# EAGLE design SML_IR-Sensor (EAGLE 9.6.2)
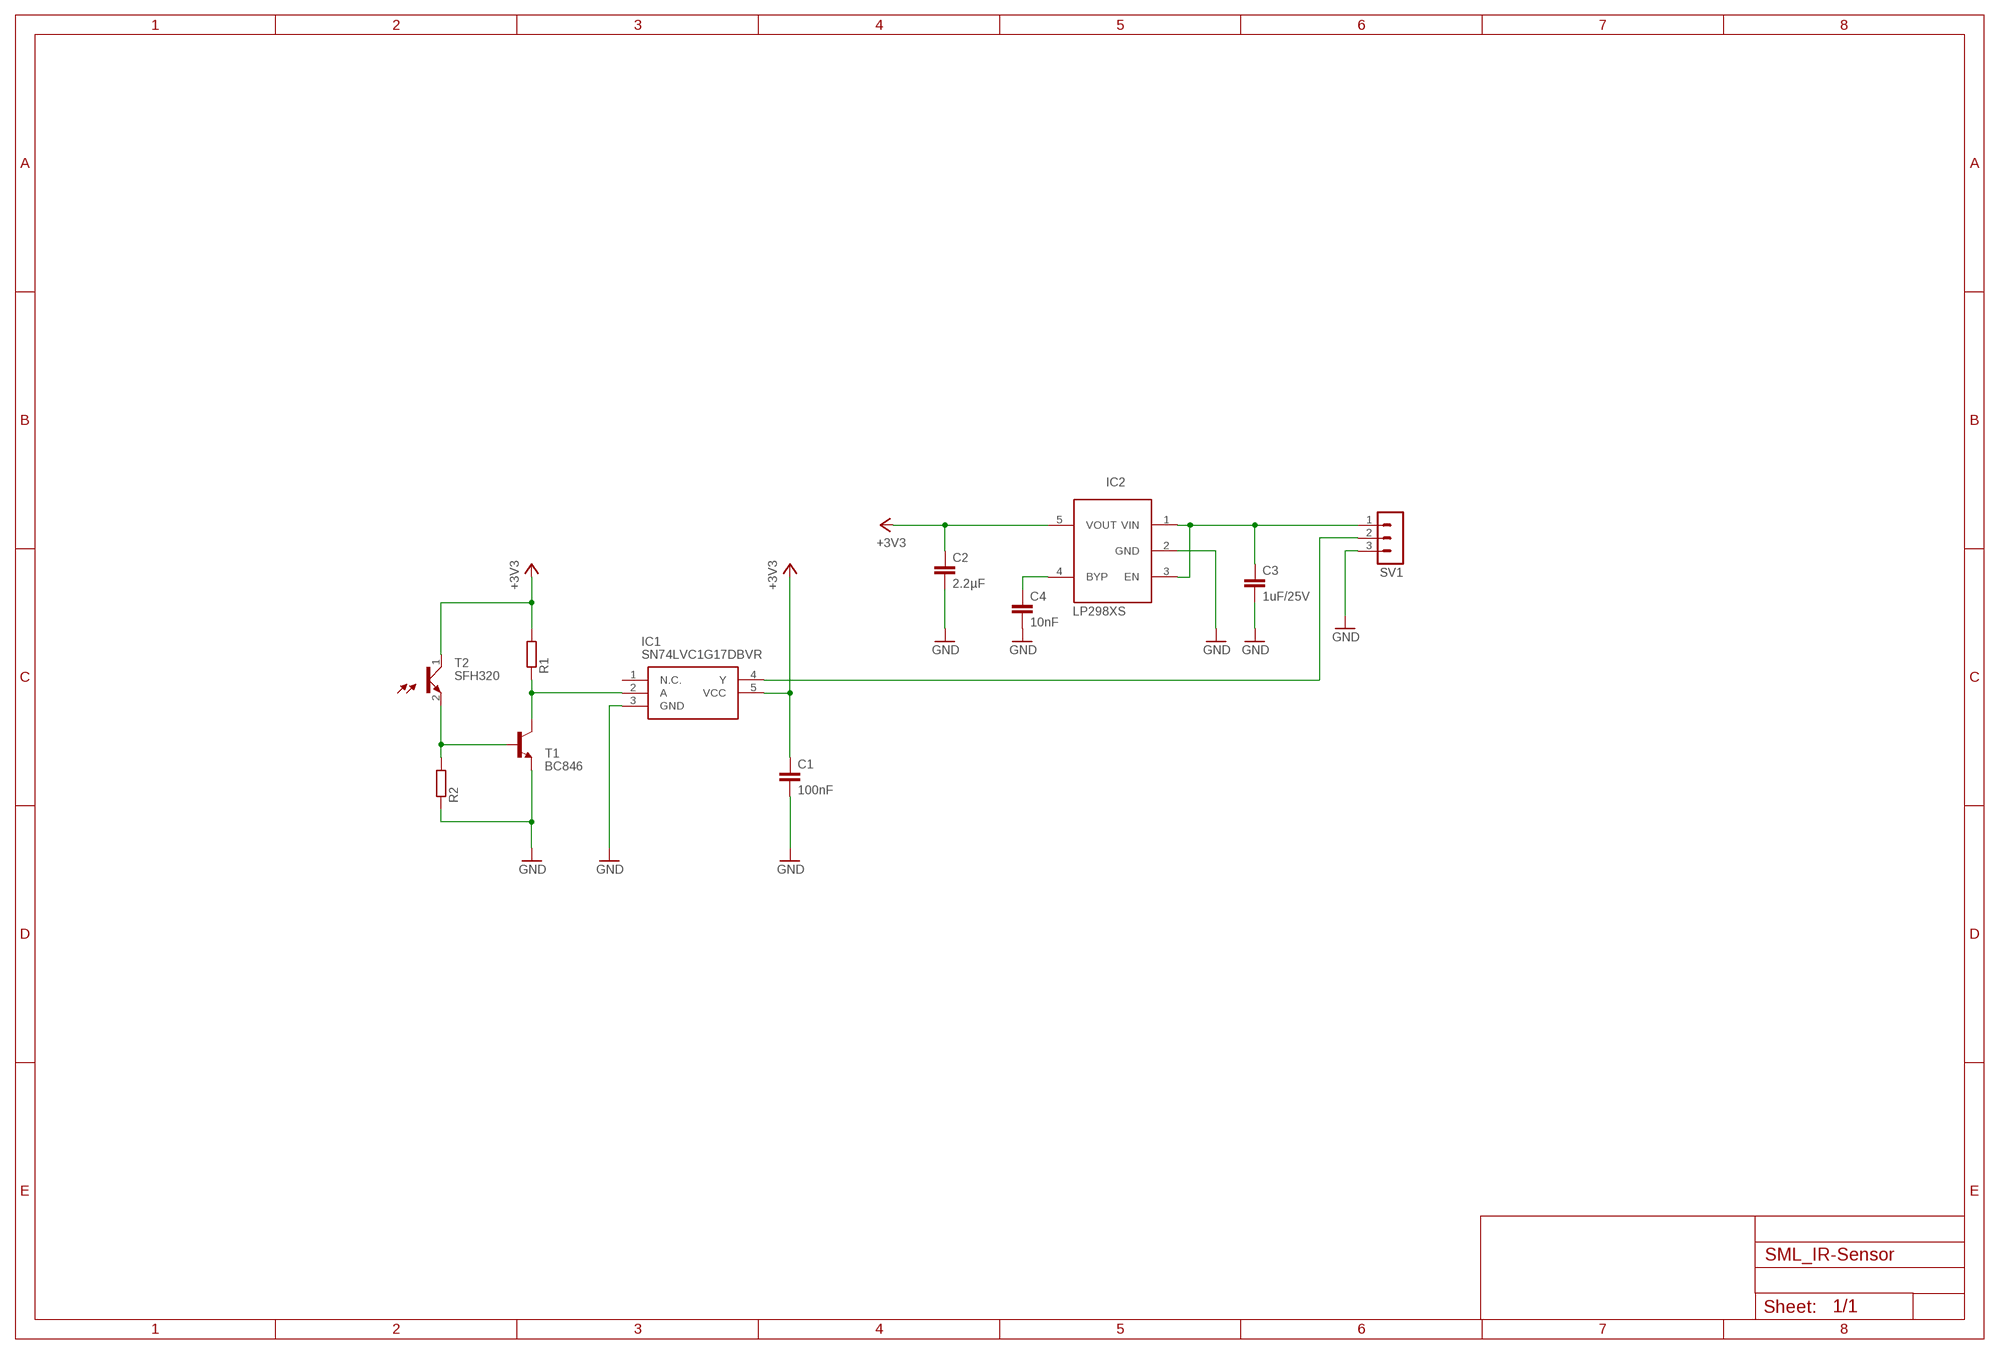
[diagram p0: schematic, sheet 1]

## Parts
C1  100nF  C-EUC0603  [C0603]
C2  2.2µF  C-EUC0603  [C0603]
C3  1uF/25V  C-EUC0603  [C0603]
C4  10nF  C-EUC0603  [C0603]
IC1  SN74LVC1G17DBVR  [SOT95P280X145-5N]
IC2  LP298XS  [SOT23-5L]
R1  R-EU_R0603  [R0603]
R2  R-EU_R0603  [R0603]
SV1  MA03-1  [MA03-1]
T1  BC846  [SOT23]
T2  SFH320  [LEDM3528X210N]

## Nets
+3V3: C1.1 C2.1 IC1.5(VCC) IC2.5(VOUT) R1.2 T2.1(C)
GND: C1.2 C2.2 C3.2 C4.2 IC1.3(GND) IC2.2(GND) R2.1 SV1.3 T1.2(E)
N$1: IC1.2(A) R1.1 T1.3(C)
N$2: IC1.4(Y) SV1.2
N$3: R2.2 T1.1(B) T2.2(E)
N$4: C3.1 IC2.1(VIN) IC2.3(EN) SV1.1
N$5: C4.1 IC2.4(BYP)
Unconnected: IC1.1(N.C.)

## Library data of the parts
C1-C4 = rcl:C-EU: CAPACITOR, European symbol; SPICEPREFIX: C
IC1 = SamacSys_Parts:SN74LVC1G17DBVR: SINGLE SCHMITT-TRIGGER BUFFER Source: Datasheet <http://www.ti.com/lit/gpn/sn74lvc1g17>; ARROW_PART_NUMBER: SN74LVC1G17DBVR; ARROW_PRICE-STOCK: https://www.arrow.com/en/products/sn74lvc1g17dbvr/texas-instruments; DESCRIPTION: SINGLE SCHMITT-TRIGGER BUFFER; HEIGHT: 1.45mm; MANUFACTURER_NAME: Texas Instruments; MANUFACTURER_PART_NUMBER: SN74LVC1G17DBVR; MOUSER_PART_NUMBER: 595-SN74LVC1G17DBVR; MOUSER_PRICE-STOCK: https://www.mouser.co.uk/ProductDetail/Texas-Instruments/SN74LVC1G17DBVR?qs=fvkeCqCHl3BQIcdbAa1fbQ%3D%3D
IC2 = adafruit:LP298X
R1 R2 = rcl:R-EU_: RESISTOR, European symbol; SPICEPREFIX: R
SV1 = con-lstb:MA03-1: PIN HEADER; OC_FARNELL: unknown; OC_NEWARK: unknown
T1 = transistor:BC846: NPN TRANSISTOR
T2 = SamacSys_Parts:SFH320: PHOTO-TRANSISTOR SMT-TOPLED Source: Datasheet <https://datasheet.datasheetarchive.com/originals/distributors/Datasheets-31/DSA-617595.pdf>; DESCRIPTION: PHOTO-TRANSISTOR SMT-TOPLED; HEIGHT: 2.1mm; MANUFACTURER_NAME: OSRAM; MANUFACTURER_PART_NUMBER: SFH320; MOUSER_PART_NUMBER: 720-SFH320D2471; MOUSER_PRICE-STOCK: https://www.mouser.co.uk/ProductDetail/OSRAM-Opto-Semiconductors/SFH320?qs=vMfUvKt%2FSL8CB4lBd2R0yw%3D%3D

## Board
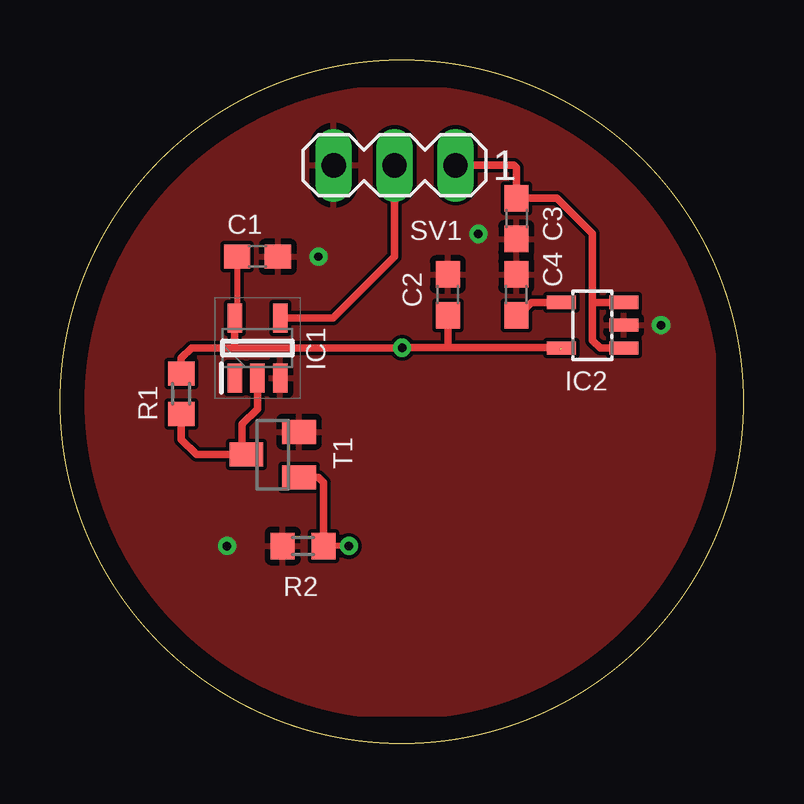
[diagram p1: board, top side]
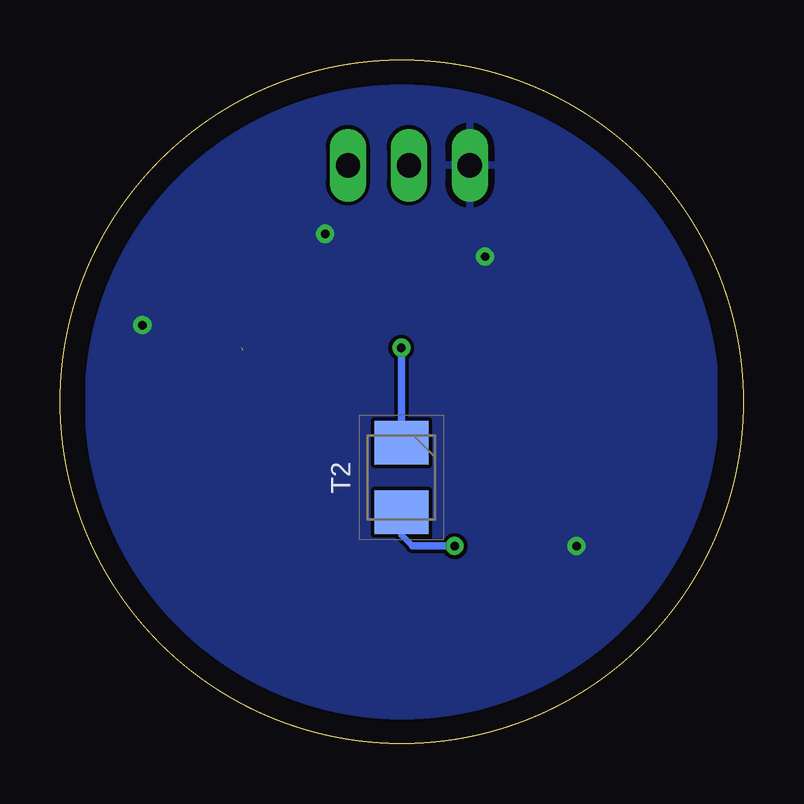
[diagram p2: board, bottom side, seen from below]

Size 28.5 x 28.5 mm. Coordinates in mm from the lower left corner, seen from the top.
Outline: circle at 14.25,14.25 radius 14.25
Copper layers (1*16): Top 0.035mm / dielectric 1.5mm / Bottom 0.035mm
Design rules "default": minimum track width 6mil, minimum drill 0.35mm, track to track 6mil, track to pad 6mil, pad to pad 6mil, via to via 6mil, smd to smd 6mil, copper to edge 40mil, drill to drill 6mil, minimum pad ring 10mil, minimum via ring 8mil, stop-mask expansion 4mil, vias tented up to drill 0mil, thermal gap 10mil

### Footprints (pad centres in the part's own frame; a part is rotated, then mirrored left to right if it is on the bottom)
C0603 = smd 1.1 x 1: 1 -0.85,0; 2 0.85,0
SOT95P280X145-5N = smd 1.2 x 0.6: 1 -1.25,0.95; 2 -1.25,0; 3 -1.25,-0.95; 4 1.25,-0.95; 5 1.25,0.95
SOT23-5L = smd 0.55 x 1.2: 1 -0.95,-1.3; 2 0,-1.3; 3 0.95,-1.3; 4 0.95,1.3; 5 -0.95,1.3
R0603 = smd 1 x 1.1: 1 -0.85,0; 2 0.85,0
MA03-1 = drill 1.016 long: 1 -2.54,0; 2 0,0; 3 2.54,0
SOT23 = smd 1 x 1.4: 1 -0.95,-1.1; 2 0.95,-1.1; 3 0,1.1
LEDM3528X210N = smd 1.8 x 2.25: 1 -1.45,0; 2 1.45,0

### Placement (x,y rotation side)
C1  8.23,20.3 0 top
C2  16.17,18.71 90 top
C3  19.03,21.89 270 top
C4  19.03,18.71 90 top
IC1  8.23,16.49 90 top
IC2  22.2,17.44 90 top
R1  5.06,14.59 90 top
R2  10.14,8.23 0 top
SV1  13.95,24.11 180 top
T1  8.87,12.04 90 top
T2  14.27,11.09 270 bottom

### Tracks (layer width: path | path; a pad name or v marks a point on that pad's centre or on a via)
+3V3  (via drill 0.35)  (1 unrouted)
  Top 0.2: 7.24,17.79 IC1.5 | 7.29,20.2 C1.1 | IC1.5 7.45,17.58 | IC1.5
  Top 0.254: C1.1 7.38,17.94 7.24,17.79 | 7.26,17.76 IC1.5
  Top 0.305: IC1.5 7.29,16.49 | R1.2 5.06,16.07 5.48,16.49 7.29,16.49 | 20.86,16.41 20.77,16.5 16.17,16.5 | 7.29,16.49 14.26,16.49 v14.27,16.5 16.17,16.5 | C2.1 16.17,16.5
  Bottom 0.305: v14.27,16.5 T2.1
GND  (via drill 0.35)
  other vias: 6.96,8.23 17.44,21.25 10.78,20.3 25.06,17.44
  pour Top: 1.25,1.25 24.75,1.25 27.25,3.75 27.25,23.25 23.25,27.25 12.25,27.25 3.25,27.25 0.25,24.25 0.25,2.25
  pour Bottom: 1.25,1.57 1.25,0.61 27.29,0.61 27.29,24.75 27.29,27.6 4.42,27.6 1.25,27.6
N$1
  Top 0.2: R1.1 5.08,13.71 | 7.73,12.09 T1.3
  Top 0.254: 7.6,12.21 7.73,12.09 7.69,12.04
  Top 0.305: IC1.2 8.23,13.95 7.6,13.31 7.6,12.21 | 7.69,12.04 5.7,12.04 5.06,12.68 R1.1
N$2
  Top 0.254: SV1.2 13.95,23.48
  Top 0.305: IC1.4 11.39,17.74 13.95,20.3 SV1.2
N$3  (via drill 0.35)
  Top 0.2: T1.1 10.14,11.27
  Top 0.254: 10.46,11.1 T1.1 | v12.04,8.23 R2.2
  Top 0.305: T1.1 10.78,11.1 10.99,10.88 R2.2
  Bottom 0.254: T2.2 14.27,8.69 13.81,8.23
  Bottom 0.305: 13.81,8.23 v12.04,8.23
N$4
  Top 0.305: SV1.1 18.93,24.11 19.03,24.01 C3.1 20.72,22.74 22.2,21.25 22.2,18.39 | IC2.1 22.52,16.49 22.2,16.81 22.2,18.39 | IC2.3 22.21,18.39 22.2,18.39
N$5
  Top 0.305: C4.1 19.25,18.08 19.35,18.08 19.66,18.39 IC2.4